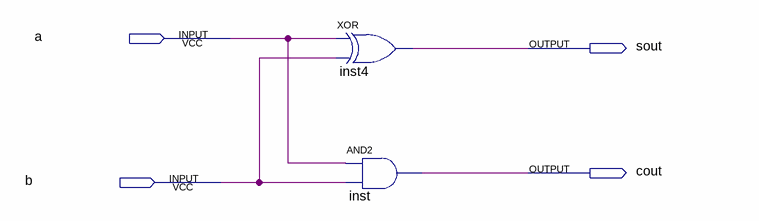
[diagram p0: schematic sheet]
// Quartus schematic Halfadder.bdf as structural Verilog: 2 symbols, 4 pins
module Halfadder (
  input  a,
  input  b,
  output sout,
  output cout
);

  xor inst4 (sout, a, b);
  and inst (cout, a, b);
endmodule
